# EAGLE design msxpi_v0.7 (EAGLE 7.7.0)
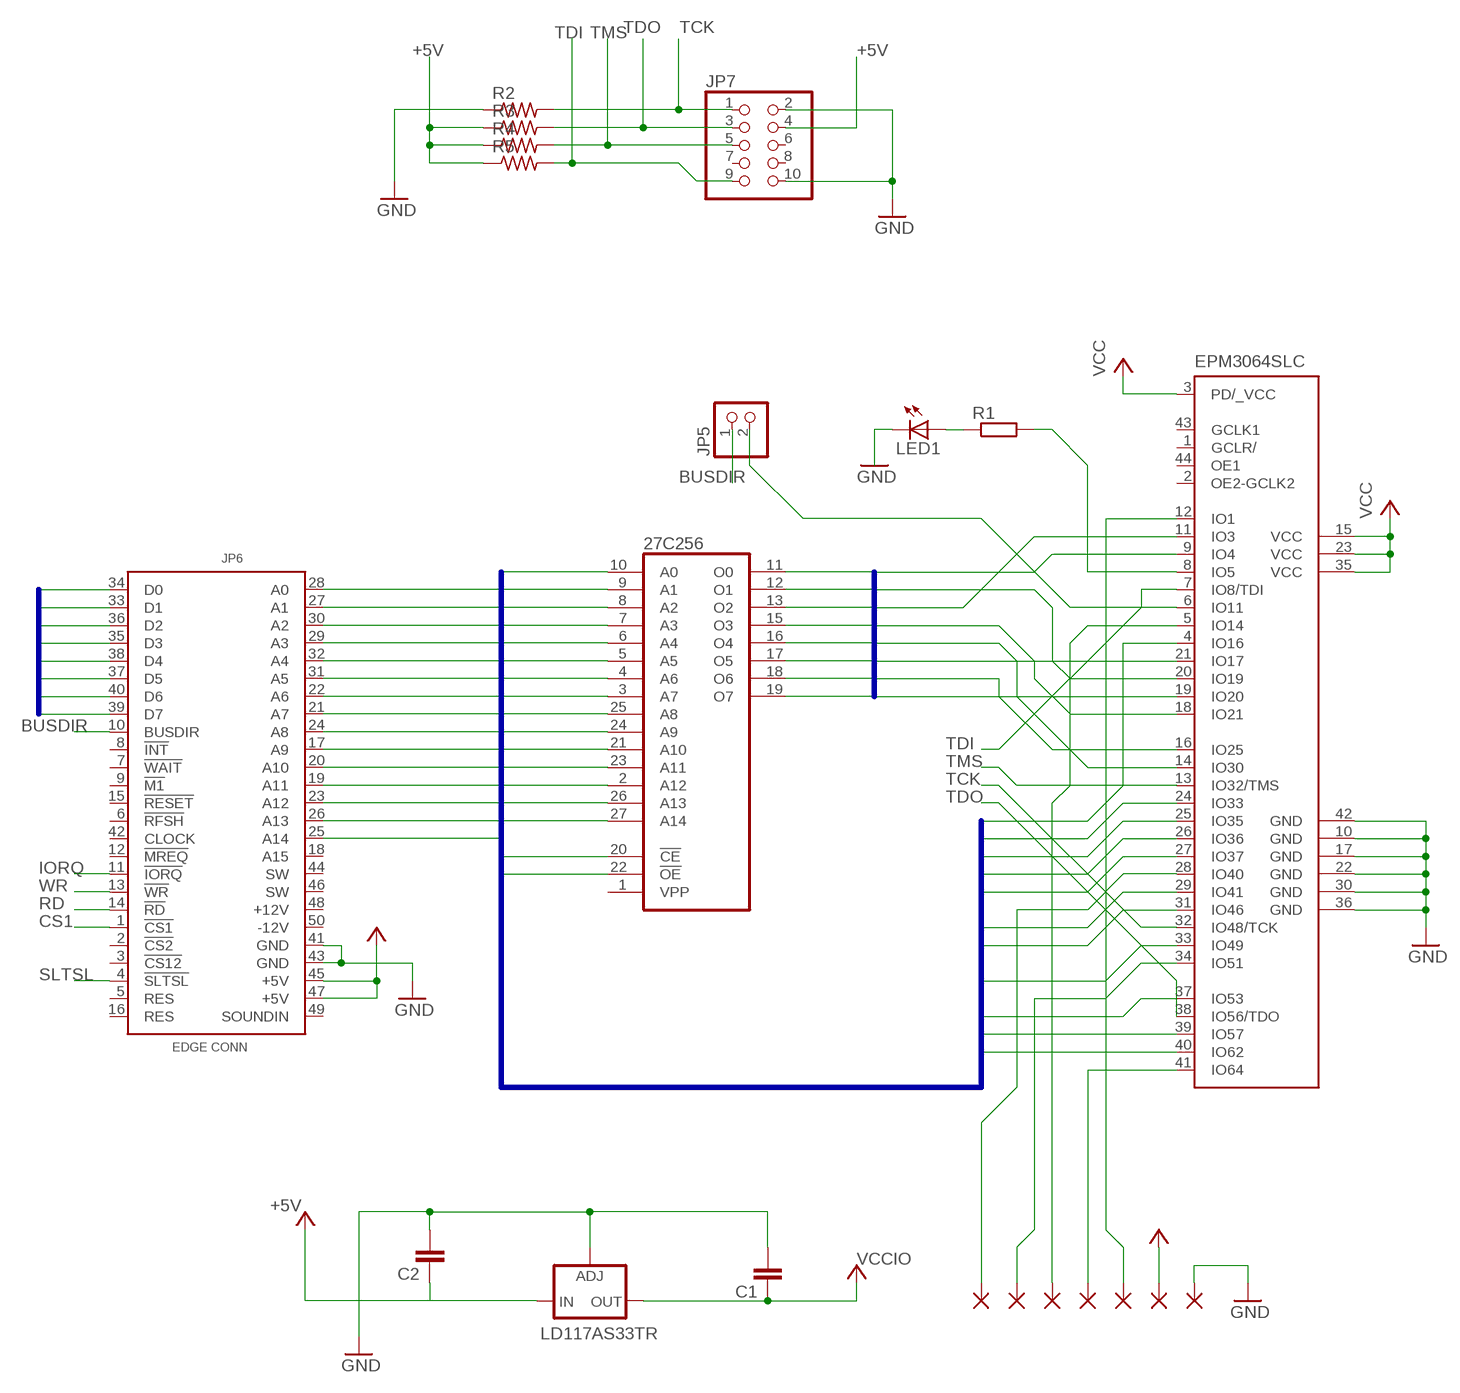
[diagram p0: schematic, sheet 1]

## Parts
27C256  27256  [DIL28]
+5V  2,15/1,0  [2,15/1,0]
C1  C2,5-3  [C2.5-3]
C2  C2,5-3  [C2.5-3]
EPM3064SLC  EPM3064S44  [PLCC-S44]
GND  2,15/1,0  [2,15/1,0]
IC1  LD117AS33TR  [SOT223]
JP5  PINHD-1X2  [1X02]
JP6  MSXCART1  [MSXCART]
JP7  PINHD-2X5/90  [2X05/90]
LED1  LED3MM  [LED3MM]
PAD1  2,15/1,0  [2,15/1,0]
PAD2  2,15/1,0  [2,15/1,0]
PAD8  2,15/1,0  [2,15/1,0]
PAD9  2,15/1,0  [2,15/1,0]
R1  R-EU_0207/7  [0207/7]
R2  R-US_0207/7  [0207/7]
R3  R-US_0207/7  [0207/7]
R4  R-US_0207/7  [0207/7]
R5  R-US_0207/7  [0207/7]
SPI_CS_GPIO21  2,15/1,0  [2,15/1,0]

## Nets
+5V: +5V.1(P) C2.1 IC1.3(IN) JP6.45(+5V) JP6.47(+5V) JP7.4 R3.1 R4.1 R5.1 ; supply symbol labelled VCC
A0: 27C256.10(A0) EPM3064SLC.31(IO46) JP6.28(A0)
A1: 27C256.9(A1) EPM3064SLC.29(IO41) JP6.27(A1)
A2: 27C256.8(A2) EPM3064SLC.24(IO33) JP6.30(A2)
A3: 27C256.7(A3) EPM3064SLC.26(IO36) JP6.29(A3)
A4: 27C256.6(A4) EPM3064SLC.25(IO35) JP6.32(A4)
A5: 27C256.5(A5) EPM3064SLC.27(IO37) JP6.31(A5)
A6: 27C256.4(A6) EPM3064SLC.33(IO49) JP6.22(A6)
A7: 27C256.3(A7) EPM3064SLC.4(IO16) JP6.21(A7)
A8: 27C256.25(A8) JP6.24(A8)
A9: 27C256.24(A9) JP6.17(A9)
A10: 27C256.21(A10) JP6.20(A10)
A11: 27C256.23(A11) JP6.19(A11)
A12: 27C256.2(A12) JP6.23(A12)
A13: 27C256.26(A13) JP6.26(A13)
A14: 27C256.27(A14) JP6.25(A14)
BUSDIR: JP5.1 JP6.10(BUSDIR)
CS1: 27C256.22(!OE) JP6.1(!CS1)
D0: 27C256.11(O0) EPM3064SLC.9(IO4) JP6.34(D0)
D1: 27C256.12(O1) EPM3064SLC.20(IO19) JP6.33(D1)
D2: 27C256.13(O2) EPM3064SLC.11(IO3) JP6.36(D2)
D3: 27C256.15(O3) EPM3064SLC.18(IO21) JP6.35(D3)
D4: 27C256.16(O4) EPM3064SLC.14(IO30) JP6.38(D4)
D5: 27C256.17(O5) EPM3064SLC.21(IO17) JP6.37(D5)
D6: 27C256.18(O6) EPM3064SLC.16(IO25) JP6.40(D6)
D7: 27C256.19(O7) EPM3064SLC.19(IO20) JP6.39(D7)
GND: C1.2 C2.2 EPM3064SLC.10(GND) EPM3064SLC.17(GND) EPM3064SLC.22(GND) EPM3064SLC.30(GND) EPM3064SLC.36(GND) EPM3064SLC.42(GND) GND.1(P) IC1.1(ADJ) JP6.41(GND) JP6.43(GND) JP7.2 JP7.10 LED1.K(C) R2.1
IORQ: EPM3064SLC.40(IO62) JP6.11(!IORQ)
MSXR1: EPM3064SLC.6(IO11) JP5.2
N$5: LED1.A R1.1
N$6: EPM3064SLC.8(IO5) R1.2
PI_RDY_GPIO25: EPM3064SLC.12(IO1) PAD2.1(P)
RD: EPM3064SLC.37(IO53) JP6.14(!RD)
SLTSL: 27C256.20(!CE) JP6.4(!SLTSL)
SPI_CS_GPIO21: EPM3064SLC.28(IO40) SPI_CS_GPIO21.1(P)
SPI_MISO_GPIO12: EPM3064SLC.41(IO64) PAD1.1(P)
SPI_MOSI_GPIO16: EPM3064SLC.5(IO14) PAD9.1(P)
SPI_SCLK_GPIO20: EPM3064SLC.34(IO51) PAD8.1(P)
TCK: EPM3064SLC.32(IO48/TCK) JP7.1 R2.2
TDI: EPM3064SLC.7(IO8/TDI) JP7.9 R5.2
TDO: EPM3064SLC.38(IO56/TDO) JP7.3 R3.2
TMS: EPM3064SLC.13(IO32/TMS) JP7.5 R4.2
VCCIO: C1.1 EPM3064SLC.3(PD/_VCC) EPM3064SLC.15(VCC) EPM3064SLC.23(VCC) EPM3064SLC.35(VCC) IC1.4(OUT) ; supply symbol labelled VCC
WR: EPM3064SLC.39(IO57) JP6.13(!WR)
Unconnected: 27C256.1(VPP) EPM3064SLC.1(GCLR/) EPM3064SLC.2(OE2-GCLK2) EPM3064SLC.43(GCLK1) EPM3064SLC.44(OE1) JP6.2(!CS2) JP6.3(!CS12) JP6.5(RES) JP6.6(!RFSH) JP6.7(!WAIT) JP6.8(!INT) JP6.9(!M1) JP6.12(!MREQ) JP6.15(!RESET) JP6.16(RES) JP6.18(A15) JP6.42(CLOCK) JP6.44(SW) JP6.46(SW) JP6.48(+12V) JP6.49(SOUNDIN) JP6.50(-12V) JP7.6 JP7.7 JP7.8

## Buses
A[0..14],CS1,SLTSL,RD,WR,IORQ
D[0..7]

## Power pins joined to a net without a drawn wire
+5V: 27C256.28(VCC)
GND: 27C256.14(GND)

## Library data of the parts
27C256 = memory:27256: MEMORY
+5V GND PAD1 PAD2 PAD8 PAD9 SPI_CS_GPIO21 = wirepad:2,15/1,0: THROUGH-HOLE PAD
C1 C2 = capacitor-wima:C: CAPACITOR naming: grid - package width
EPM3064SLC = EPM3064-PLCC:EPM3064: EPM3064 MAX 3000 family PLCC through hole socket; MPN: EPM3064SLC44-10N
IC1 = v-reg:LD117A?*: Low drop fixed and adjustable positive voltage regulators 1 A Source: http://www.st.com/stonline/products/literature/ds/7194/ld1117axx.pdf
JP5 = pinhead:PINHD-1X2: PIN HEADER
JP6 = msx-con-fbelavenuto:MSXCART
JP7 = pinhead:PINHD-2X5: PIN HEADER
LED1 = led:LED: LED OSRAM: - CHIPLED LG R971, LG N971, LY N971, LG Q971, LY Q971, LO R971, LY R971 LH N974, LH R974 LS Q976, LO Q976, LY Q976 LO Q996 - Hyper CHIPLED LW Q18S LB Q993, LB Q99A, LB R99A - SideLED LS A670, LO A670, LY A670, LG A670, LP A670 LB A673, LV A673, LT A673, LW A673 LH A674 LY A675 LS A676, LA A676, LO A676, LY A676, LW A676 LS A679, LY A679, LG A679 - Hyper Micro SIDELED® LS Y876, LA Y876, LO Y876, LY Y876 LT Y87S - SmartLED LW L88C, LW L88S LB L89C, LB L89S, LG L890 LS L89K, LO L89K, LY L89K LS L896, LA L896, LO L896, LY L896 - TOPLED LS T670, LO T670, LY T670, LG T670, LP T670 LSG T670, LSP T670, LSY T670, LOP T670, LYG T670 LG T671, LOG T671, LSG T671 LB T673, LV T673, LT T673, LW T673 LH T674 LS T676, LA T676, LO T676, LY T676, LB T676, LH T676, LSB T676, LW T676 LB T67C, LV T67C, LT T67C, LS T67K, LO T67K, LY T67K, LW E67C LS E67B, LA E67B, LO E67B, LY E67B, LB E67C, LV E67C, LT E67C LW T67C LS T679, LY T679, LG T679 LS T770, LO T770, LY T770, LG T770, LP T770 LB T773, LV T773, LT T773, LW T773 LH T774 LS E675, LA E675, LY E675, LS T675 LS T776, LA T776, LO T776, LY T776, LB T776 LHGB T686 LT T68C, LB T68C - Hyper Mini TOPLED® LB M676 - Mini TOPLED Santana® LG M470 LS M47K, LO M47K, LY M47K Source: http://www.osram.convergy.de LUXEON: - LUMILED® LXK2-PW12-R00, LXK2-PW12-S00, LXK2-PW14-U00, LXK2-PW14-V00 LXK2-PM12-R00, LXK2-PM12-S00, LXK2-PM14-U00 LXK2-PE12-Q00, LXK2-PE12-R00, LXK2-PE12-S00, LXK2-PE14-T00, LXK2-PE14-U00 LXK2-PB12-K00, LXK2-PB12-L00, LXK2-PB12-M00, LXK2-PB14-N00, LXK2-PB14-P00, LXK2-PB14-Q00 LXK2-PR12-L00, LXK2-PR12-M00, LXK2-PR14-Q00, LXK2-PR14-R00 LXK2-PD12-Q00, LXK2-PD12-R00, LXK2-PD12-S00 LXK2-PH12-R00, LXK2-PH12-S00 LXK2-PL12-P00, LXK2-PL12-Q00, LXK2-PL12-R00 Source: www.luxeon.com KINGBRIGHT: KA-3528ASYC Source: www.kingbright.com
R1 = rcl:R-EU_: RESISTOR, European symbol
R2-R5 = rcl:R-US_: RESISTOR, American symbol

## Board
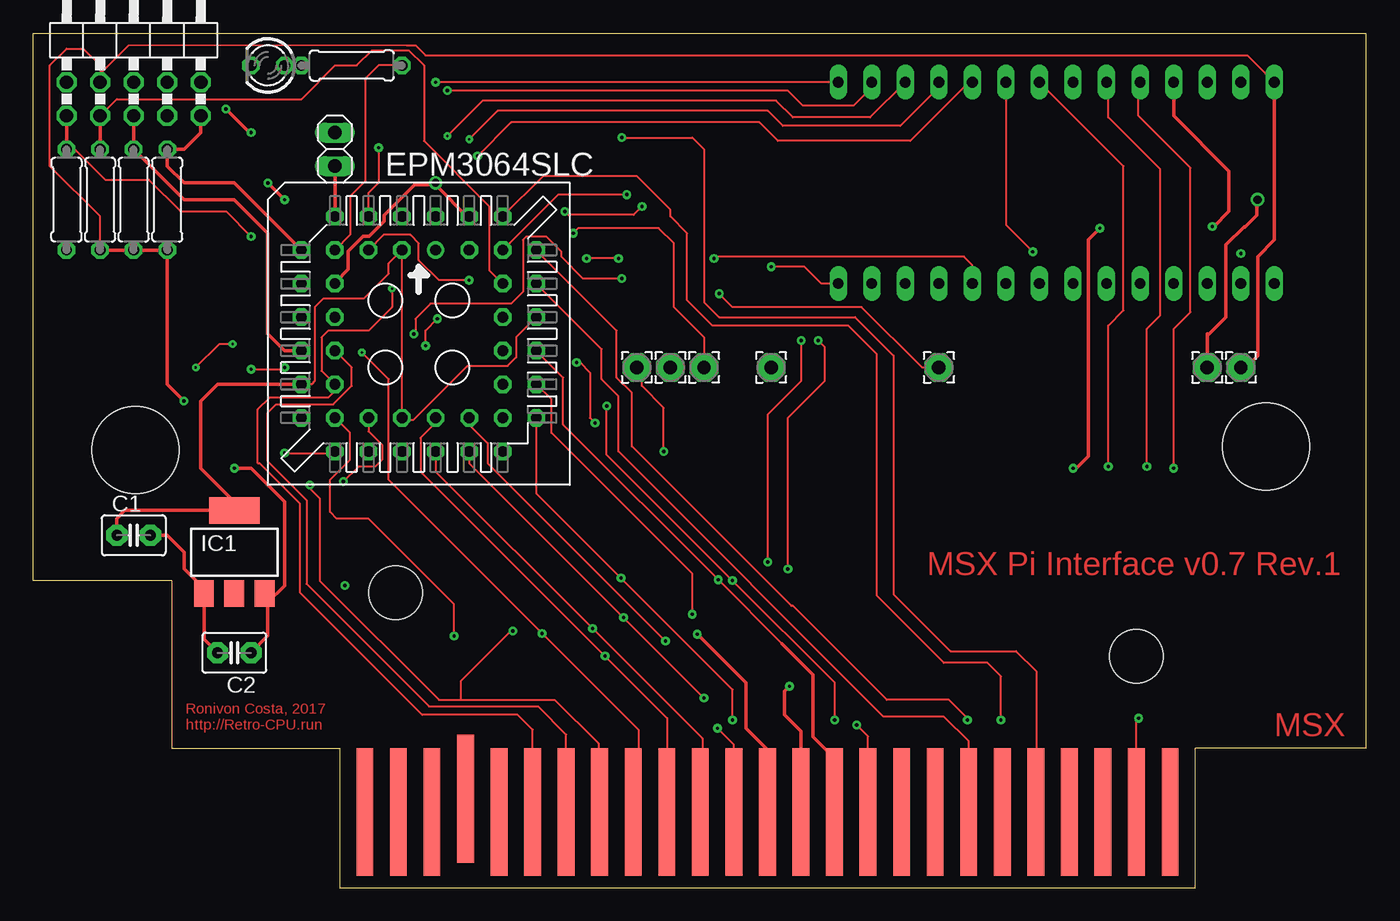
[diagram p1: board, top side]
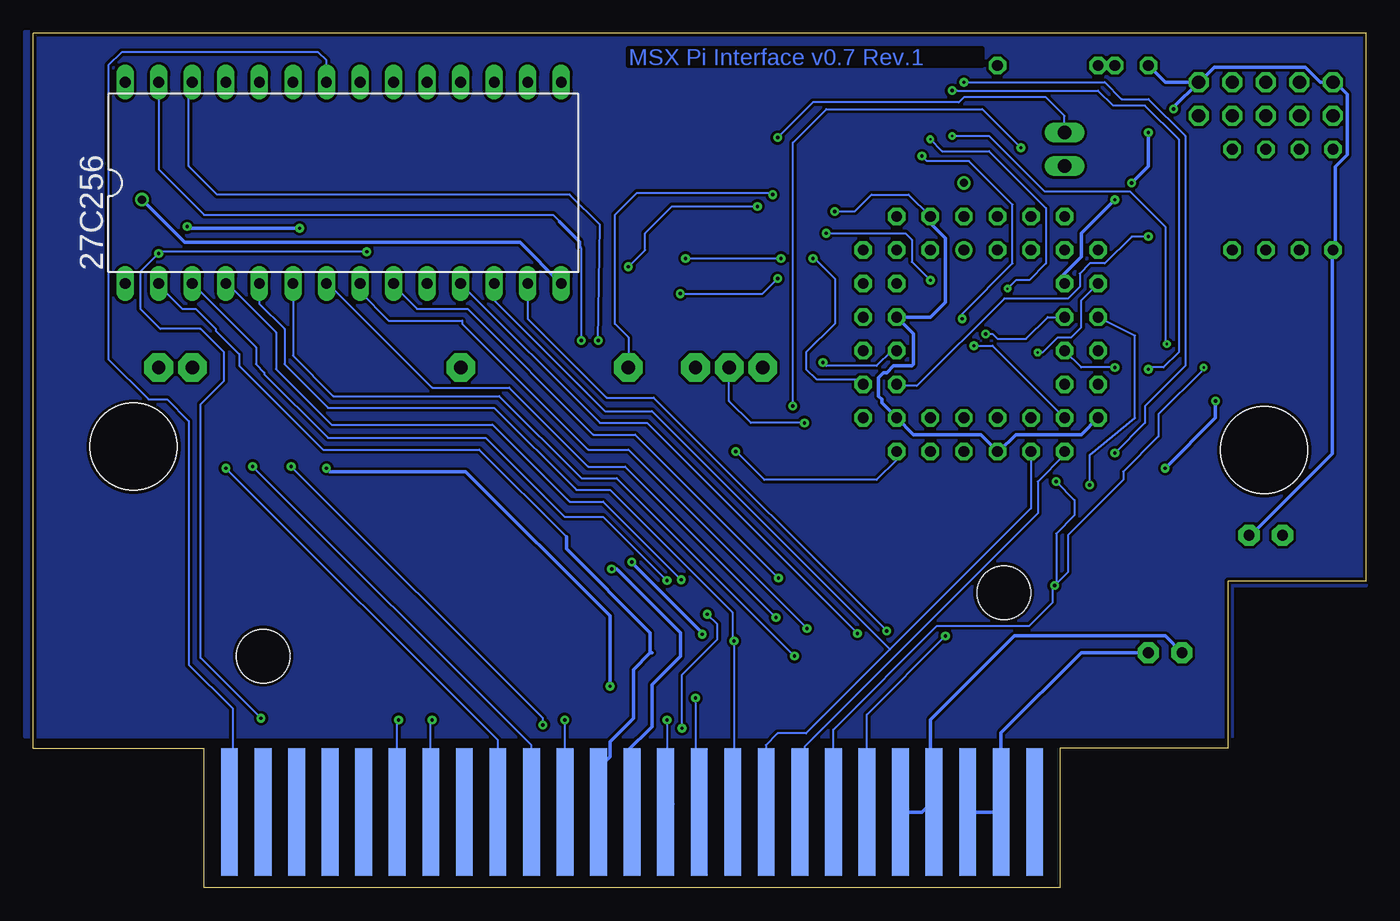
[diagram p2: board, bottom side, seen from below]

Size 100.96 x 64.68 mm. Coordinates in mm from the lower left corner, seen from the top.
Copper layers (1*16): Top 0.035mm / dielectric 1.5mm / Bottom 0.035mm
Design rules "default *": minimum track width 10mil, minimum drill 24mil, track to track 8mil, track to pad 8mil, pad to pad 8mil, via to via 8mil, smd to smd 8mil, copper to edge 10mil, drill to drill 8mil, minimum pad ring 10mil, minimum via ring 8mil, stop-mask expansion 4mil, vias tented up to drill 0mil, thermal gap 10mil

### Footprints (pad centres in the part's own frame; a part is rotated, then mirrored left to right if it is on the bottom)
DIL28 = drill 0.813 long: 1 -16.51,-7.62; 2 -13.97,-7.62; 3 -11.43,-7.62; 4 -8.89,-7.62; 5 -6.35,-7.62; 6 -3.81,-7.62; 7 -1.27,-7.62; 8 1.27,-7.62; 9 3.81,-7.62; 10 6.35,-7.62; 11 8.89,-7.62; 12 11.43,-7.62; 13 13.97,-7.62; 14 16.51,-7.62; 15 16.51,7.62; 16 13.97,7.62; 17 11.43,7.62; 18 8.89,7.62; 19 6.35,7.62; 20 3.81,7.62; 21 1.27,7.62; 22 -1.27,7.62; 23 -3.81,7.62; 24 -6.35,7.62; 25 -8.89,7.62; 26 -11.43,7.62; 27 -13.97,7.62; 28 -16.51,7.62
2,15/1,0 = drill 1.016 pad 2.159 octagon: 1 0,0
C2.5-3 = drill 0.813 pad 1.6 octagon: 1 -1.27,0; 2 1.27,0
PLCC-S44 = drill 0.813: 1 1.27,6.35 | drill 0.813 octagon: 2 -1.27,8.89; 3 -1.27,6.35; 4 -3.81,8.89; 5 -3.81,6.35; 6 -6.35,8.89; 7 -8.89,6.35; 8 -6.35,6.35; 9 -8.89,3.81; 10 -6.35,3.81; 11 -8.89,1.27; 12 -6.35,1.27; 13 -8.89,-1.27; 14 -6.35,-1.27; 15 -8.89,-3.81; 16 -6.35,-3.81; 17 -8.89,-6.35; 18 -6.35,-8.89; 19 -6.35,-6.35; 20 -3.81,-8.89; 21 -3.81,-6.35; 22 -1.27,-8.89; 23 -1.27,-6.35; 24 1.27,-8.89; 25 1.27,-6.35; 26 3.81,-8.89; 27 3.81,-6.35; 28 6.35,-8.89; 29 8.89,-6.35; 30 6.35,-6.35; 31 8.89,-3.81; 32 6.35,-3.81; 33 8.89,-1.27; 34 6.35,-1.27; 35 8.89,1.27; 36 6.35,1.27; 37 8.89,3.81; 38 6.35,3.81; 39 8.89,6.35; 40 6.35,8.89; 41 6.35,6.35; 42 3.81,8.89; 43 3.81,6.35; 44 1.27,8.89
SOT223 = smd 1.5 x 2: 1 -2.3,-3.15; 2 0,-3.15; 3 2.3,-3.15 | smd 3.8 x 2: 4 0,3.15
1X02 = drill 1.016 long: 1 -1.27,0; 2 1.27,0
MSXCART = smd 1.27 x 9.652 bottom: 1 86.081,5.715; 3 83.541,5.715; 5 81.001,5.715; 7 78.461,5.715; 9 75.921,5.715; 11 73.381,5.715; 13 70.841,5.715; 15 68.301,5.715; 17 65.761,5.715; 19 63.221,5.715; 21 60.681,5.715; 23 58.141,5.715; 25 55.601,5.715; 27 53.061,5.715; 29 50.521,5.715; 31 47.981,5.715; 33 45.441,5.715; 35 42.901,5.715; 37 40.361,5.715; 39 37.821,5.715; 41 35.281,5.715; 43 32.741,5.715; 45 30.201,5.715; 47 27.661,5.715; 49 25.121,5.715 | smd 1.27 x 9.652: 2 86.081,5.715; 4 83.541,5.715; 6 81.001,5.715; 8 78.461,5.715; 10 75.921,5.715; 12 73.381,5.715; 14 70.841,5.715; 16 68.301,5.715; 18 65.761,5.715; 20 63.221,5.715; 22 60.681,5.715; 24 58.141,5.715; 26 55.601,5.715; 28 53.061,5.715; 30 50.521,5.715; 32 47.981,5.715; 34 45.441,5.715; 36 42.901,5.715; 38 40.361,5.715; 40 37.821,5.715; 42 35.281,5.715; 44 32.741,6.731; 46 30.201,5.715; 48 27.661,5.715; 50 25.121,5.715 | hole 4.064: 27.461,22.326; 83.53,17.526 | hole 6.604: 93.349,33.388; 7.742,33.118
2X05/90 = drill 1.016 octagon: 1 -5.08,-6.35; 2 -5.08,-3.81; 3 -2.54,-6.35; 4 -2.54,-3.81; 5 0,-6.35; 6 0,-3.81; 7 2.54,-6.35; 8 2.54,-3.81; 9 5.08,-6.35; 10 5.08,-3.81
LED3MM = drill 0.813 octagon: A -1.27,0; K 1.27,0
0207/7 = drill 0.813 octagon: 1 -3.81,0; 2 3.81,0

### Placement (x,y rotation side)
27C256  77.47,53.34 0 bottom
+5V  91.44,39.37 0 top
C1  7.62,26.67 0 top
C2  15.24,17.78 180 top
EPM3064SLC  29.21,41.91 0 top
GND  88.9,39.37 0 top
IC1  15.24,25.4 0 top
JP5  22.86,55.88 270 top
JP6  0,0 0 top
JP7  7.62,64.77 0 top
LED1  17.78,62.23 180 top
PAD1  55.88,39.37 0 top
PAD2  68.58,39.37 0 top
PAD8  48.26,39.37 0 top
PAD9  50.8,39.37 0 top
R1  24.13,62.23 0 top
R2  2.54,52.07 90 top
R3  5.08,52.07 90 top
R4  7.62,52.07 90 top
R5  10.16,52.07 90 top
SPI_CS_GPIO21  45.72,39.37 0 top

### Tracks (layer width: path | path; a pad name or v marks a point on that pad's centre or on a via)
+5V  (via drill 0.25)
  Top 0.127: JP7.4 5.08,61.6 7.24,63.75 28.32,63.75
  Top 0.152: 27C256.28 91.95,62.99 29.72,62.99 28.96,63.75 28.32,63.75 | R3.1 5.08,50.8 1.27,54.61 1.27,62.23 2.54,63.5 3.81,63.5 5.08,62.23 JP7.4
  Top 0.254: C2.1 17.78,19.05 17.78,21.59 | 17.78,21.59 17.78,22.01 IC1.3 | 27C256.28 93.98,49.02 92.71,47.75 92.71,40.26 91.82,39.37 +5V.1 | R3.1 R4.1 R5.1 10.16,38.1 v11.43,36.83 | v15.24,31.75 16.51,31.75 19.05,29.21 19.05,22.86 17.78,21.59
  Bottom 0.254: C2.1 21.59,17.78 27.66,11.71 JP6.47 JP6.45 | v11.43,36.83 11.43,35.56 v15.24,31.75
A0  (via drill 0.25 pad 0.25)
  Top 0.152: 27C256.10 71.12,47.12 70.48,47.75 51.69,47.75 v51.56,47.62 | v44.32,47.62 v41.91,47.62 | JP6.28 53.06,10.82 v51.82,12.06 | v49.91,20.7 49.91,23.75 39.24,34.42 39.24,36.96 EPM3064SLC.31
  Bottom 0.152: v51.56,47.62 v44.32,47.62 | EPM3064SLC.31 38.48,38.48 41.66,38.48 42.42,39.24 42.42,40.51 40.26,42.67 40.26,46.1 41.78,47.62 v41.91,47.62 | v51.82,12.06 51.82,16.13 49.15,18.8 49.15,19.94 v49.91,20.7
A1  (via drill 0.25 pad 0.25)
  Top 0.152: v52.96,12.7 52.96,14.99 v44.51,23.43 38.29,29.65 38.23,29.72 38.1,29.85 EPM3064SLC.29
  Bottom 0.152: 52.45,6.33 JP6.27 52.96,5.82 v52.96,12.7 | 27C256.9 73.66,45.59 71.88,43.82 68.07,43.82 58.55,34.29 55.37,34.29 v44.51,23.43
A2  (via drill 0.25 pad 0.25)
  Top 0.152: EPM3064SLC.24 30.48,31.5 v42.35,19.62 50.67,11.3 50.67,5.87 JP6.30
  Bottom 0.152: 27C256.8 76.2,45.09 74.04,42.93 68.45,42.93 68.45,42.67 58.93,33.15 55.88,33.15 v42.35,19.62
A3  (via drill 0.25 pad 0.25)
  Top 0.152: EPM3064SLC.26 33.02,32.13 v44.7,20.45 v50.8,14.35
  Bottom 0.152: 50.42,5.82 JP6.29 50.8,5.99 v50.8,14.35 | 27C256.7 78.61,45.72 70.74,37.85 64.9,37.85 58.93,31.88 56.13,31.88 v44.7,20.45
A4  (via drill 0.25 pad 0.25)
  Top 0.152: EPM3064SLC.25 30.48,35.18 29.34,34.04 29.34,31.5 v43.31,17.53 48.01,12.83 48.01,5.74 JP6.32
  Bottom 0.152: 27C256.6 81.28,40.26 78.23,37.21 65.66,37.21 59.44,30.99 56.77,30.99 v43.31,17.53
A5  (via drill 0.25 pad 0.25)
  Top 0.152: EPM3064SLC.27 33.02,35.05 34.42,33.66 34.42,32.13 v47.88,18.67
  Bottom 0.152: JP6.31 47.88,5.82 v47.88,18.67 48.01,18.8 48.01,20.83 57.28,30.1 59.82,30.1 66.04,36.32 78.61,36.32 81.91,39.62 81.91,42.29 83.82,44.2 27C256.5
A6  (via drill 0.25 pad 0.25)
  Top 0.152: JP6.22 60.68,10.44 | 57.02,18.16 56.71,18.48 v51.88,23.3 40.13,35.05 40.13,38.61 EPM3064SLC.33
  Top 0.254: 60.68,10.44 60.05,10.44 59.05,11.43 59.05,16.13 56.71,18.48
  Bottom 0.152: 27C256.4 86.23,45.72 82.55,42.04 82.55,39.24 78.36,35.05 66.17,35.05 60.33,29.21 57.78,29.21 v51.88,23.3
A7  (via drill 0.25 pad 0.25)
  Top 0.152: EPM3064SLC.4 25.4,52.58 26.16,53.34 v26.16,56.01 | v60.71,12.7 60.71,15.49 v52.96,23.24 43.43,32.77 v43.43,36.45
  Bottom 0.152: v43.43,36.45 43.43,56.39 40.89,58.93 29.08,58.93 v26.16,56.01 | JP6.21 60.68,12.68 v60.71,12.7 | 27C256.3 88.9,45.47 88.65,45.47 84.07,40.89 84.07,39.62 83.44,38.99 83.44,38.86 78.61,34.04 66.67,34.04 60.71,28.07 57.78,28.07 v52.96,23.24
A8  (via drill 0.25 pad 0.25)
  Top 0.254: JP6.24 58.14,11.84 56.9,13.08 56.9,14.86 v57.28,15.24 | v78.74,31.75 78.99,31.75 79.88,32.64 79.88,49.02 v80.77,49.91 | v89.28,50.04 89.41,50.04 90.55,51.18 90.55,54.23 86.36,58.42 27C256.25
  Bottom 0.254: v57.28,15.24 57.28,20.57 68.2,31.5 78.49,31.5 v78.74,31.75 | v80.77,49.91 89.15,49.91 v89.28,50.04
A9  (via drill 0.25 pad 0.25)
  Top 0.152: v86.36,31.75 86.36,42.29 87.63,43.56 87.63,54.48 83.69,58.42 83.69,60.83 27C256.24
  Bottom 0.152: JP6.17 65.76,11.15 v86.36,31.75
A10  (via drill 0.25 pad 0.25)
  Top 0.152: JP6.20 63.22,11.45 v62.36,12.32 | v81.41,31.88 81.41,42.55 82.55,43.69 82.55,54.61 27C256.21
  Bottom 0.152: v62.36,12.32 62.36,12.83 v81.41,31.88
A11  (via drill 0.25 pad 0.25)
  Top 0.152: v84.33,31.88 84.33,42.29 85.34,43.31 85.34,54.36 81.41,58.29 81.41,60.83 27C256.23
  Bottom 0.152: JP6.19 63.22,10.77 v84.33,31.88
A12
  Bottom 0.152: 27C256.2 91.44,45.59 89.66,43.82 88.65,43.82 87.12,42.29 87.12,42.16 85.34,40.39 85.34,39.5 78.99,33.15 67.18,33.15 60.58,26.54
  Bottom 0.254: 60.58,26.54 60.58,25.65 54.23,19.3 54.23,17.91 54.1,17.78 54.23,17.78 55.5,16.51 55.5,12.83 57.28,11.05 57.28,9.91 58.55,8.64 58.55,6.12 JP6.23
A13  (via drill 0.25 pad 0.25)
  Top 0.152: v55.63,24.64 55.63,35.81 58.17,38.35 v58.17,41.4
  Top 0.254: JP6.26 55.6,10.44 53.97,12.06 53.97,15.49 v50.29,19.18
  Bottom 0.152: v58.17,41.4 58.04,50.16 60.33,52.45 87,52.45 89.15,54.61 89.15,60.71 27C256.26
  Bottom 0.254: v50.29,19.18 50.29,19.3 v55.63,24.64
A14  (via drill 0.25 pad 0.25)
  Top 0.152: v57.15,24.13 57.15,35.56 59.94,38.35 59.94,40.89 v59.44,41.4
  Bottom 0.152: JP6.25 55.6,6.73 55.6,9.88 | v59.44,41.4 59.44,48.39 59.56,48.51 | 27C256.27 91.44,54.36 88.01,50.93 61.59,50.93 60.33,49.66
  Bottom 0.254: v57.15,24.13 56.77,24.13 51.94,19.3 51.94,17.53 54.1,15.37 54.1,12.19 56.01,10.29 56.01,7.14 55.6,6.73 | 59.56,48.51 59.56,48.9 60.33,49.66 61.09,50.42
BUSDIR  (via drill 0.25 pad 0.25)
  Top 0.152: v44.58,56.77 49.91,56.77 50.8,55.88 50.8,44.32 51.94,43.18 62.23,43.18 65.15,40.26 65.15,22.22 69.47,17.91 74.42,17.91 75.95,16.38 75.95,5.74 JP6.10
  Bottom 0.152: JP5.1 22.86,58.42 24.26,59.82 30.48,59.82 30.86,59.44 41.91,59.44 v44.58,56.77
CS1
  Bottom 0.152: 27C256.22 78.74,62.61 79.38,63.25 94.23,63.25 95.25,62.23 95.25,40.01 92.2,36.96 90.8,36.96 89.15,35.31 89.15,16.89 85.85,13.59 85.85,5.94 JP6.1
D0  (via drill 0.17, 0.25 pad 0.25)
  Top 0.152: v24.89,40.51 26.92,38.48 26.92,30.86 v38.54,19.24 45.85,11.94 45.85,6.12 JP6.34
  Bottom 0.152: v24.89,40.51 24.51,40.51 23.37,41.66 22.35,41.66 21.59,42.42 21.59,44.45 EPM3064SLC.9 | 27C256.11 58.04,35.18 54.48,35.18 v38.54,19.24
D1
  Bottom 0.152: EPM3064SLC.20 25.4,28.7 36.07,18.03 | 36.07,18.03 42.42,11.68 44.58,11.68 45.47,10.79 45.47,6.48 45.59,6.35 45.59,5.87 JP6.33 | 27C256.12 66.04,44.45 57.66,36.07 54.1,36.07 36.07,18.03
D2  (via drill 0.25, 0.25 pad 0.25)
  Top 0.152: JP6.36 42.9,8.53 42.8,8.64 42.8,10.92 39.5,14.22 32.38,14.22 | v20.96,30.48 20.96,30.23 21.72,29.46 21.72,23.24 30.73,14.22 32.38,14.22 | v36.32,19.43 36.2,19.43 32.38,15.62 32.38,14.22
  Bottom 0.152: v20.96,30.48 20.96,32.77 17.53,35.56 17.53,41.78 EPM3064SLC.11 | 27C256.13 63.5,43.05 57.53,37.08 53.97,37.08 v36.32,19.43
D3  (via drill 0.25)
  Top 0.152: 27C256.15 v30.48,60.96 | v19.05,32.89 22.86,32.89 EPM3064SLC.18
  Bottom 0.152: v19.05,32.89 16.76,35.18 16.76,36.45 13.72,39.5 13.72,56.9 16.51,59.69 18.54,59.69 19.81,60.96 v30.48,60.96 | EPM3064SLC.18 22.86,32.77 24.89,30.73 24.89,28.32 42.54,10.67 42.54,6.07 JP6.35
D4  (via drill 0.25 pad 0.25)
  Top 0.152: JP6.38 40.36,11.58 38.23,13.72 29.97,13.72 20.7,22.99 20.7,29.34 17.78,32.26 17.78,35.94 18.42,36.58 22.73,36.58 24.13,37.97 24.13,39.37 EPM3064SLC.14 | 27C256.16 63.5,60.58 62.1,59.18 58.29,59.18 57.15,60.32 v31.37,60.32 | v16.51,39.24 18.92,39.24 v19.05,39.37
  Bottom 0.152: 30.99,60.32 v31.37,60.32 20.32,60.32 19.18,59.18 16.76,59.18 14.22,56.64 14.22,40.51 15.37,39.37 16.38,39.37 v16.51,39.24 | v19.05,39.37 21.59,39.37 EPM3064SLC.14
D5  (via drill 0.17 pad 0.25, 0.25, 0.25 pad 0.25)
  Top 0.152: 27C256.17 63.37,58.29 57.53,58.29 56.26,59.56 34.04,59.56 v31.37,56.9 | v15.11,41.15 14.1,41.15 v12.32,39.37 | EPM3064SLC.21 25.4,34.54 26.42,33.53 26.42,32.39 25.91,31.88 24.64,31.88 v23.5,30.73
  Bottom 0.152: JP6.37 40.36,11.96 32.51,19.81 25.53,19.81 23.75,21.59 23.75,22.73 v23.62,22.86 | v31.37,56.9 28.57,56.9 24.38,52.71 17.91,52.71 15.24,50.04 15.24,41.28 v15.11,41.15 | v12.32,39.37 12.32,39.24 15.75,35.81 15.75,34.16 18.42,31.5 18.42,30.86 22.61,26.67 22.61,23.88 v23.62,22.86 | v23.5,30.73 22.1,29.34 22.1,28.19 23.5,26.8 23.5,22.99 v23.62,22.86
D6  (via drill 0.17 pad 0.25)
  Top 0.152: JP6.40 37.82,11.96 36.7,13.08 29.46,13.08 20.19,22.35 20.19,29.08 17.14,32.13 17.02,32.13 17.02,36.2 17.91,37.08 22.35,37.08 22.86,37.59 EPM3064SLC.16 21.84,39.12 21.84,41.66 22.35,42.16 25.4,42.16 27.18,43.94 v27.18,45.34 | 27C256.18 68.58,60.58 65.66,57.66 56.77,57.66 55.63,58.8 35.18,58.8 v33.02,56.64
  Bottom 0.152: v33.02,56.64 32.13,55.75 28.57,55.75 24.26,51.44 24.26,47.24 25.53,45.97 26.54,45.97 v27.18,45.34
D7  (via drill 0.25 pad 0.25)
  Top 0.152: 27C256.19 70.87,60.96 66.42,56.52 56.39,56.52 54.99,57.91 36.2,57.91 v33.66,55.37 | v29.72,41.02 29.72,42.16 v30.61,43.05 | EPM3064SLC.19 24,34.42 24,32.39 22.48,30.86 22.48,28.45 22.99,27.94 25.4,27.94 31.88,21.46 v31.88,19.05
  Bottom 0.152: 37.85,5.74 JP6.39 37.82,13.11 v31.88,19.05 | v30.61,43.05 30.61,43.43 26.8,47.24 26.8,51.69 30.1,54.99 33.27,54.99 v33.66,55.37 | v29.72,41.02 28.32,41.02 EPM3064SLC.19
GND  (via drill 0.25, 0.61 pad 0.25)
  Top 0.152: 27C256.14 59.69,45.72 58.42,46.99 v55.88,46.99 | v46.1,51.56 45.47,50.93 40.51,50.93 v40.26,51.18
  Top 0.254: C2.2 12.94,18.81 IC1.1 12.94,22.62 11.43,24.13 11.43,25.4 10.16,26.67 C1.2 | 88.9,41.78 90.3,43.18 90.3,48.64 91.69,50.04 91.75,49.99 92.66,50.9 92.66,52.05 v92.71,52.07 | 30.48,53.19 32.99,50.67 EPM3064SLC.42 | 30.48,53.19 28.88,53.19 26.59,50.9 26.59,50.44 25.45,49.3 24.99,49.3 23.85,48.16 23.85,46.79 22.94,45.87 EPM3064SLC.10 | 30.48,53.19 v30.48,53.34 | 88.9,41.78 88.9,41.91 | 88.9,41.78 GND.1 | v19.05,52.07 v17.78,53.34 | v16.51,57.15 16.38,57.15 v14.6,58.93
  Bottom 0.152: v55.88,46.99 54.61,48.26 54.61,49.53 52.58,51.56 v46.1,51.56 | v40.26,51.18 38.73,51.18 37.46,52.45 34.67,52.45 EPM3064SLC.42
  Bottom 0.254: C2.2 15.24,19.05 26.67,19.05 33.02,12.7 33.02,6.35 | 33.02,6.35 33.02,5.99 JP6.43 | JP6.41 33.66,5.72 33.02,6.35 | EPM3064SLC.42 33.02,50.29 31.88,49.15 31.88,44.32 33.02,43.18 EPM3064SLC.36 34.29,41.91 34.29,39.62 34.42,39.5 35.81,39.5 36.32,38.99 36.58,38.99 36.96,38.61 36.96,37.21 36.7,36.96 36.7,36.7 EPM3064SLC.30 34.29,34.29 29.21,34.29 EPM3064SLC.22 27.81,33.02 26.54,34.29 21.59,34.29 EPM3064SLC.17 | LED1.K 15.24,60.96 JP7.10 | EPM3064SLC.10 22.99,45.85 22.99,46.36 21.59,47.75 21.59,49.53 v19.05,52.07 | v92.71,52.07 92.66,52.05 89.46,48.84 64.08,48.84 27C256.14 | JP7.10 12.65,60.96 11.51,62.1 4.65,62.1 3.51,60.96 JP7.2 2.36,60.96 1.45,60.05 1.45,55.47 2.36,54.56 2.36,48.39 R2.1 2.59,48.16 2.59,32.84 8.76,26.67 C1.2 | v17.78,53.34 16.51,54.61 v16.51,57.15 | v14.6,58.93 14.6,59.05 JP7.10
IORQ  (via drill 0.25 pad 0.25)
  Top 0.152: v73.28,12.7 73.28,16 72.26,17.02 68.96,17.02 63.88,22.1 63.88,40.39 61.72,42.55 51.43,42.55 49.53,44.45 49.53,49.53 48.26,50.8 48.26,51.31 45.72,53.85 38.61,53.85 EPM3064SLC.40
  Bottom 0.152: JP6.11 73.38,12.6 v73.28,12.7
MSXR1
  Top 0.254: JP5.2 EPM3064SLC.6
N$1
  pour Bottom: 0,64.77 101.6,64.77 101.6,11.43 10.16,11.43 10.16,22.86 0,22.86
N$5
  Top 0.254: LED1.A R1.1
N$6
  Top 0.152: R1.2 26.16,62.23 25.15,61.21 25.15,53.47 24,52.32 24,49.4 EPM3064SLC.8
PI_RDY_GPIO25  (via drill 0.25 pad 0.25)
  Top 0.152: v51.94,44.96 52.96,43.94 62.74,43.94 67.31,39.37 PAD2.1 | v44.58,46.1 41.66,46.1 40,47.75 40,48.13 38.86,49.28 37.34,49.28 37.08,49.02 37.08,45.09 36.2,44.2 30.1,44.2 28.96,43.05 28.96,42.04 v28.83,41.91
  Bottom 0.152: v51.94,44.96 45.72,44.96 v44.58,46.1 | v28.83,41.91 28.32,41.91 27.94,41.53 25.78,41.53 24.13,43.18 EPM3064SLC.12
RD
  Top 0.152: JP6.14 70.84,11.07 68.96,12.95 64.39,12.95 44.32,33.02 44.32,37.21 43.05,38.48 43.05,40.77 EPM3064SLC.37
SLTSL  (via drill 0.25 pad 0.25)
  Top 0.152: JP6.4 83.54,12.68 v83.69,12.83 | 27C256.20 73.66,50.16 v75.69,48.13 | 91.31,48.13 v91.44,48.01
  Bottom 0.152: v83.69,12.83 88.27,17.4 88.27,36.58 86.49,38.35 86.49,40.51 88.27,42.29 91.31,42.29 92.84,43.82 92.84,46.61 v91.44,48.01 91.31,48.13 v75.69,48.13
SPI_CS_GPIO21  (via drill 0.25 pad 0.25)
  Top 0.152: v47.75,33.02 47.75,36.32 46.1,37.97 46.1,38.99
  Top 0.254: 46.1,38.99 SPI_CS_GPIO21.1
  Bottom 0.152: EPM3064SLC.28 35.56,32.39 37.08,30.86 45.59,30.86 v47.75,33.02
SPI_MISO_GPIO12  (via drill 0.25 pad 0.25)
  Top 0.152: v44.96,52.45 39.75,52.45 EPM3064SLC.41
  Bottom 0.152: v44.96,52.45 45.09,52.58 55.24,52.58 56.9,50.93 56.9,42.67 55.88,41.66 PAD1.1
SPI_MOSI_GPIO16  (via drill 0.25 pad 0.25)
  Top 0.152: v40.89,49.53 41.27,49.91 47.37,49.91 48.51,48.77 48.51,43.94 50.8,41.66 PAD9.1 | v33.02,45.97 30.73,45.97 29.21,47.5 29.21,48.77 28.57,49.4 26.54,49.4 EPM3064SLC.5
  Bottom 0.152: v40.89,49.53 34.92,49.53 34.42,49.02 34.42,47.37 v33.02,45.97
SPI_SCLK_GPIO20  (via drill 0.25 pad 0.25)
  Top 0.152: v41.15,39.75 41.4,39.75 42.16,38.99 42.16,35.56 v42.54,35.18
  Bottom 0.152: EPM3064SLC.34 35.94,40.64 37.08,39.5 40.89,39.5 v41.15,39.75 | v42.54,35.18 46.61,35.18 48.26,36.83 PAD8.1
TCK  (via drill 0.25)
  Top 0.152: R2.2 3.18,55.88 5.46,53.59 8.76,53.59 11.18,51.18 14.6,51.18 v16.51,49.28
  Top 0.254: JP7.1 R2.2
  Bottom 0.152: v16.51,49.28 17.78,49.28 19.81,47.24 20.96,47.24 21.72,46.48 21.72,45.47 22.61,44.58 27.43,44.58 34.04,37.97 35.43,37.97 EPM3064SLC.32
TDI
  Top 0.254: JP7.9 12.7,57.15 11.43,55.88 R5.2 10.16,54.61 11.43,53.34 15.24,53.34 EPM3064SLC.7
TDO
  Top 0.152: JP7.3 6.35,59.69 20.32,59.69 22.86,62.23 24.51,62.23 25.65,63.37 28.45,63.37 29.59,62.23 29.59,56.52 34.54,51.56 34.54,46.74 EPM3064SLC.38
  Top 0.254: JP7.3 R3.2
TMS
  Top 0.254: JP7.5 R4.2 11.43,52.07 15.24,52.07 17.78,49.53 17.78,41.91 19.05,40.64 EPM3064SLC.13
VCCIO
  Top 0.152: EPM3064SLC.35 36.58,41.66 36.58,40.13 35.94,39.5 33.02,39.5 33.02,39.37 32.89,39.5 28.83,35.43 28.07,35.43 EPM3064SLC.23 EPM3064SLC.3 26.92,47.24 26.92,46.48 25.02,44.58 21.97,44.58 21.34,43.94 21.34,38.35 21.08,38.1 EPM3064SLC.15
  Top 0.254: C1.1 6.35,27.94 6.96,28.55 IC1.4 15.24,29.21 12.7,31.75 12.7,36.83 13.97,38.1 EPM3064SLC.15
WR  (via drill 0.25 pad 0.25)
  Top 0.152: v70.74,12.7 70.74,12.83 69.34,14.22 64.64,14.22 57.53,21.34 57.4,21.34 45.34,33.4 45.34,37.47 44.2,38.61 44.2,42.16 EPM3064SLC.39
  Bottom 0.152: JP6.13 70.84,12.6 v70.74,12.7

### Text on the board
Top: MSX Pi Interface v0.7 Rev.1 | Ronivon Costa, 2017 / http://Retro-CPU.run | MSX
Bottom: MSX Pi Interface v0.7 Rev.1